# Altium project DB10011_DieBieMPPT.PrjPCB
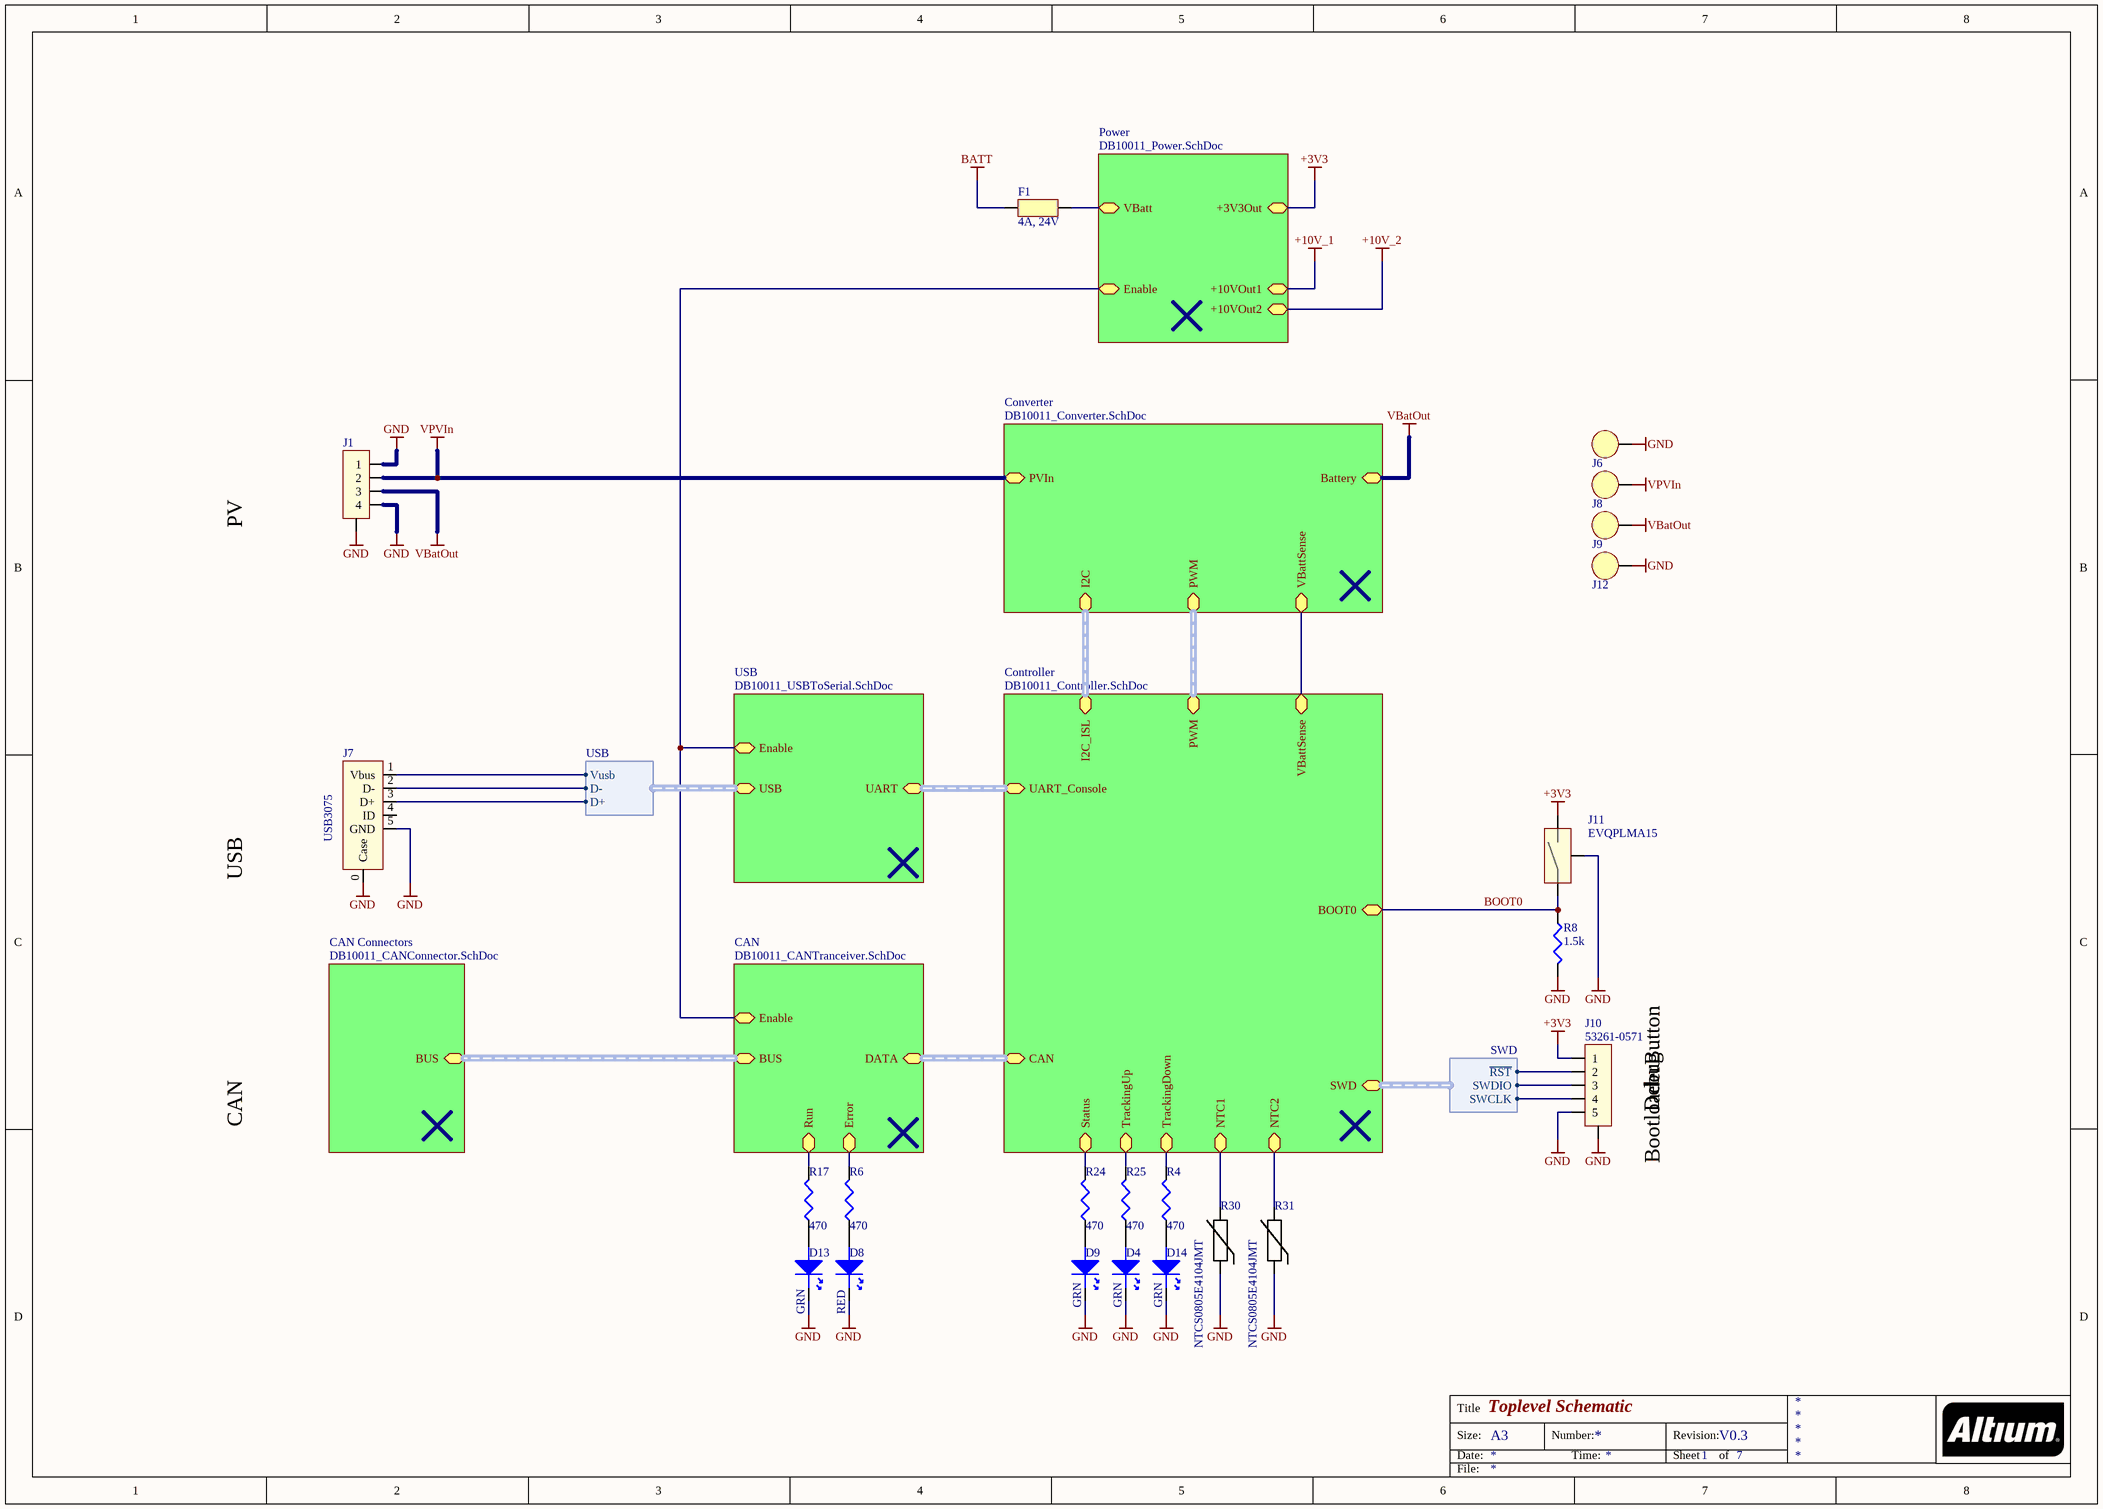
[diagram p0: DB10011_Toplevel.SchDoc]
7 sheets, 203 parts. Net scope: hierarchical (ports join the sheet entries above them; power ports are global).
Board file: DB10011_DieBieMPPT.PcbDoc
Sheets:
  DB10011_Toplevel.SchDoc
    Power = DB10011_Power.SchDoc
    Converter = DB10011_Converter.SchDoc
    Controller = DB10011_Controller.SchDoc
    CAN = DB10011_CANTranceiver.SchDoc
    USB = DB10011_USBToSerial.SchDoc
    CAN Connectors = DB10011_CANConnector.SchDoc

## Sheet DB10011_Toplevel.SchDoc: Toplevel Schematic
size A3; Engineer: Danny Bokma; Revision: V0.3; SheetNumber: 1; SheetTotal: 7

### Parts
D4  GRN  [WL-SMRW_1206 cylindrical_Reverse use]
D8  RED  [WL-SMRW_1206 cylindrical_Reverse use]
D9  GRN  [WL-SMRW_1206 cylindrical_Reverse use]
D13  GRN  [WL-SMRW_1206 cylindrical_Reverse use]
D14  GRN  [WL-SMRW_1206 cylindrical_Reverse use]
F1  4A, 24V  [F1206]
J1  Header 1x4  [PC 4/ 4-G-7,62]  (value not drawn)
J6  M3 5mm SMD spacer  [M3_5MM_Spacer]  (value not drawn)
J7  USB3075  [USB3075 - NOSLOT]
J8  M3 5mm SMD spacer  [M3_5MM_Spacer]  (value not drawn)
J9  M3 5mm SMD spacer  [M3_5MM_Spacer]  (value not drawn)
J10  53261-0571  [53261-0571]
J11  EVQPLMA15  [EVQPLM]
J12  M3 5mm SMD spacer  [M3_5MM_Spacer]  (value not drawn)
R4  470  [0402]
R6  470  [0402]
R8  1.5k  [0402]
R17  470  [0402]
R24  470  [0402]
R25  470  [0402]
R30  NTCS0805E4104JMT  [0805]
R31  NTCS0805E4104JMT  [0805]

### Sub-sheets
CAN = DB10011_CANTranceiver.SchDoc: Enable, BUS (harness CAN), Error, Run, DATA (harness CAN_DATA)
CAN Connectors = DB10011_CANConnector.SchDoc: BUS (harness CAN)
Controller = DB10011_Controller.SchDoc: I2C_ISL (harness I2C), VBattSense, PWM (harness PWM), CAN (harness CAN_DATA), UART_Console (harness SERIAL), TrackingUp, TrackingDown, Status, BOOT0, SWD (harness SWD), NTC1, NTC2
Converter = DB10011_Converter.SchDoc: PVIn, Battery, VBattSense, I2C (harness I2C), PWM (harness PWM)
Power = DB10011_Power.SchDoc: VBatt, +3V3Out, Enable, +10VOut1, +10VOut2
USB = DB10011_USBToSerial.SchDoc: UART (harness SERIAL), Enable, USB (harness USB)

### Harnesses
SWD: SWCLK, SWDIO, ~{RST}
USB: Vusb, D+, D-

### Nets
+3V3: J10.1 J11.2 ; sheet Power/+3V3Out
BATT: F1.2
GND: D4.1(K) D8.1(K) D9.1(K) D13.1(K) D14.1(K) J1.0 J1.1 J1.4 J6.0 J7.0(Case) J7.5(GND) J10.0(SHLD) J10.5 J11.0(GND) J12.0 R8.1 R30.1 R31.1
VBatOut: J1.3 J9.0 ; sheet Converter/Battery
VPVIn: J1.2 J8.0 ; sheet Converter/PVIn
BOOT0: J11.1 R8.2 ; sheet Controller/BOOT0
LED_CAN_ERROR: R17.2 ; sheet CAN/Run
LED_CAN_RUN: R6.2 ; sheet CAN/Error
LED_STATUS: R24.2 ; sheet Controller/Status
~{RST}: J10.2 ; sheet Controller/SWD.~{RST}
NetC3_2: sheet Converter/VBattSense, sheet Controller/VBattSense
NetC18_2: J7.1(Vbus) ; sheet USB/USB.Vusb
NetC74_1: R30.2 ; sheet Controller/NTC1
NetC75_1: R31.2 ; sheet Controller/NTC2
NetD4_2: D4.2(A) R25.1
NetD6_4: sheet Power/Enable, sheet CAN/Enable, sheet USB/Enable
NetD8_2: D8.2(A) R6.1
NetD9_2: D9.2(A) R24.1
NetD10_K1: J7.2(D-) ; sheet USB/USB.D-
NetD10_K2: J7.3(D+) ; sheet USB/USB.D+
NetD13_2: D13.2(A) R17.1
NetD14_2: D14.2(A) R4.1
NetF1_1: F1.1 ; sheet Power/VBatt
NetIC_14: R4.2 ; sheet Controller/TrackingDown
NetIC_15: R25.2 ; sheet Controller/TrackingUp
NetIC_23: J10.3 ; sheet Controller/SWD.SWDIO
NetIC_24: J10.4 ; sheet Controller/SWD.SWCLK

Not connected (* = marked no-connect by the designer): J7 4(ID)

### Buses and harness runs
harness sheet CAN Connectors/BUS = sheet CAN/BUS
harness sheet CAN/DATA = sheet Controller/CAN
harness sheet Controller/I2C_ISL = sheet Converter/I2C
harness sheet Controller/PWM = sheet Converter/PWM
harness sheet Controller/UART_Console = sheet USB/UART

### Notes on the sheet
- PV
- USB
- BootloaderButton
- CAN
- (near J10) Debug
- Title
- Size:
- Date:
- A3
- Number:
- Time:
- Revision:
- Sheet
- of
- File:

### Library data of the parts
D4 D9 D13 D14 = 156120GS75300: LED, Reverse Mount, Cylindrical, Green; Brand: Wurth; Brand Number: 156120GS75300; Order Code Supplier: 2322091; Price: 0,519; Supplier: Farnell
D8 = 156120RS75300: LED, Reverse Mount, Cylindrical, Red; Brand: Wurth; Brand Number: 156120RS75300; Order Code Supplier: 2322094; Price: 0,519; Supplier: Farnell
F1 = MC12CT 004: Fuse, Slow Blow, 4A, 24V, T:-55°C +125°C; Prijs: 0,161; Brand: MULTICOMP; Order Code Supplier: 1841066; Brand Number: MC12CT 004; Supplier: Farnell
J1 = PC 4/4-G-7,62_1: Header, Close Horizontal, 1x4, Male, 7.62mm, TH; Brand: PHOENIX CONTACT; Brand Number: PC 4/4-G-7,62; Case Style: *; Order Code Supplier: 1792930; Pitch: 7.62mm; Price: 2,92; Supplier: Farnell
J6 J8 J9 J12 = 9774050360RWPad: M3 5MM Spacer; Brand: WURTH ELEKTRONIK; Brand Number: 9774050360R; Price: 1.91; Order Code Supplier: 2438004; Supplier: WURTH ELEKTRONIK
J7 = USB3075: USB 2.0 MICRO B, RCPT, 5POS, SMT; Brand: Global Connector Technology; Brand Number: USB3075-30-A; Case Style: Micro B SMT; Pitch: 0.8mm; Order Code Supplier: 2443116; Price: 0,313; Supplier: Farnell
J10 = 53261-0571: PicoBlade 53261 Series, 5Pin, Right Angle; Brand: MOLEX; Pitch: 1.25mm; Brand Number: 53261-0571; Case Style: 53261-0571; Order Code Supplier: 1125360; Price: 1,20; Supplier: Farnell
J11 = EVQPLMA15: SWITCH, TACT, 4.9MM, SMD, 2.6N; Brand: PANASONIC ELECTRONIC COMPONENTS; Brand Number: EVQPLMA15; Price: 0,169; Order Code Supplier: 2079484; Supplier: Farnell
R4 R6 R17 R24 R25 = 470/0402/0063W/50V: Resistor, 470, 1%, 0.0625W, 50V, 100PPM, 0402; Brand: VISHAY DRALORIC; Brand Number: CRG0402F470R; Power Rating: 0.063W; Case Style: 0402; Order Code Supplier: 2331533; Price: 0,0099; Resistance: 470; Supplier: Farnell; Temperature Coefficient: ± 100PPM; Temperature Range: -55°C to +125°C; Voltage Rating: 50V
R8 = 1.5k/0402/0063W/50V: Resistor, 1.5k, 0.1%, 0.0625W, 50V, 100PPM, 0402; Brand: VISHAY DRALORIC; Brand Number: CRCW04021K50FKED; Power Rating: 0.063W; Case Style: 0402; Order Code Supplier: 2121624; Price: 0,0054; Resistance: 1.5k; Supplier: Farnell; Temperature Coefficient: ± 100PPM; Temperature Range: -55°C to +125°C; Voltage Rating: 50V
R30 R31 = NTCS0805E4104JMT: THERMISTOR, NTC, 100K, 5%; Brand: VISHAY; Supplier: Farnell; Case Style: 0805; Price: 0,65; Order Code Supplier: 1187095; Brand Number: NTCS0805E4104JMT

## Sheet DB10011_Power.SchDoc: Power supplies
size A3; Engineer: Danny Bokma; Revision: V0.3; SheetNumber: 4; SheetTotal: 7
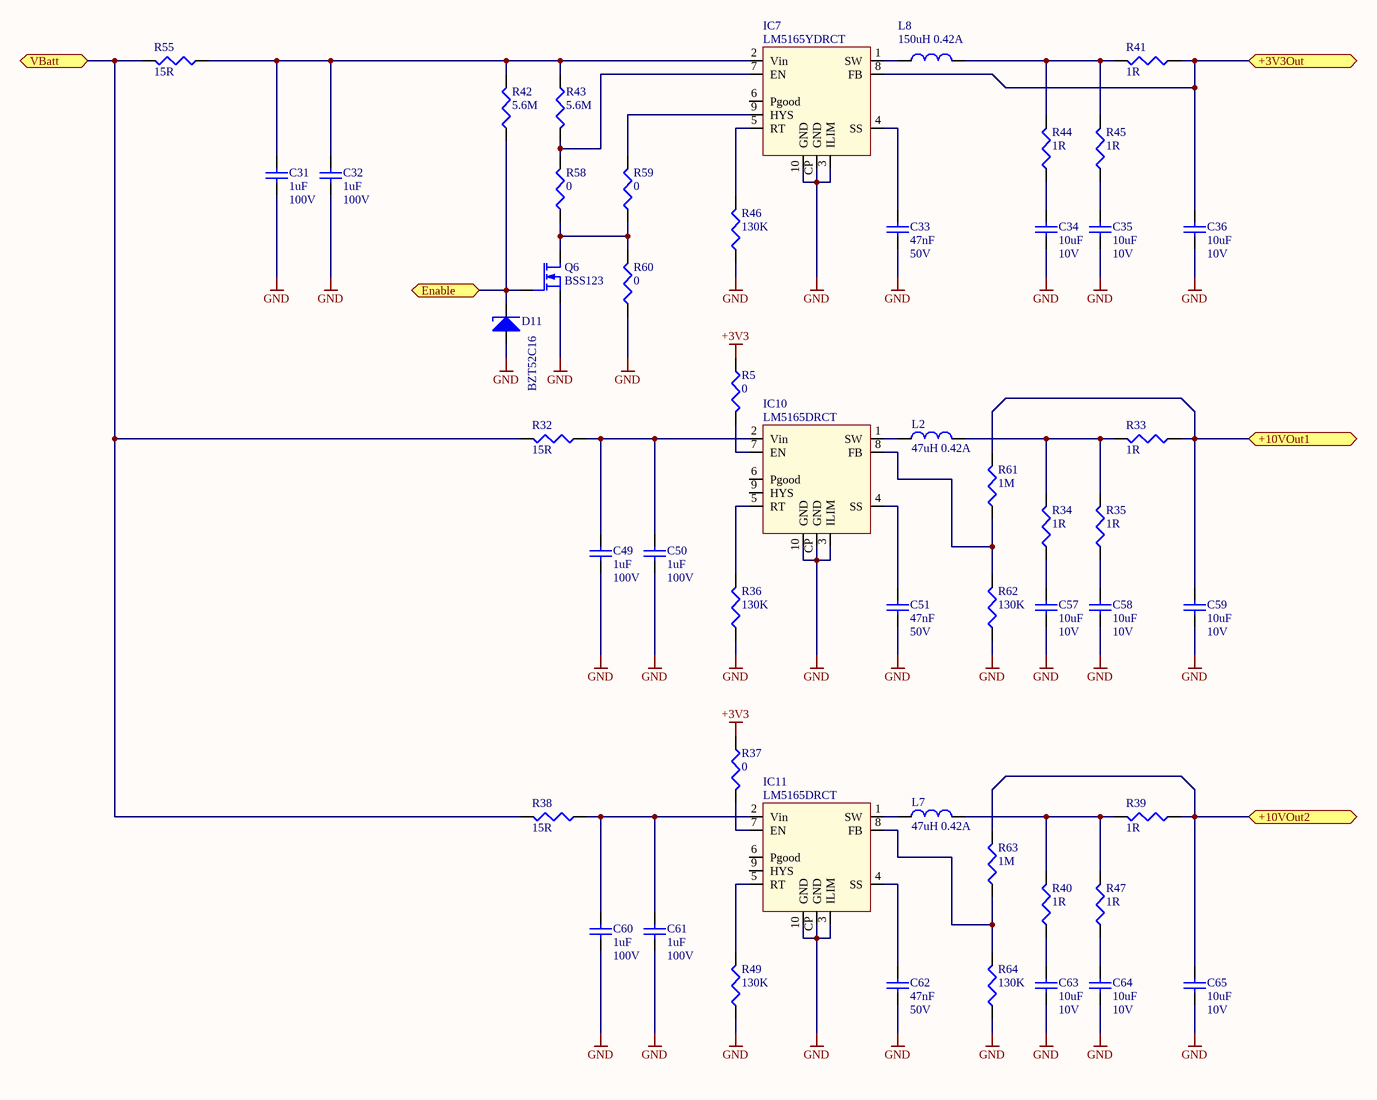
[diagram p1: DB10011_Power.SchDoc]

### Parts
C31  1uF  Voltage Rating: 100V  [C-1206]
C32  1uF  Voltage Rating: 100V  [C-1206]
C33  47nF  Voltage Rating: 50V  [C0603]
C34  10uF  Voltage Rating: 10V  [C-0805]
C35  10uF  Voltage Rating: 10V  [C-0805]
C36  10uF  Voltage Rating: 10V  [C-0805]
C49  1uF  Voltage Rating: 100V  [C-1206]
C50  1uF  Voltage Rating: 100V  [C-1206]
C51  47nF  Voltage Rating: 50V  [C0603]
C57  10uF  Voltage Rating: 10V  [C-0805]
C58  10uF  Voltage Rating: 10V  [C-0805]
C59  10uF  Voltage Rating: 10V  [C-0805]
C60  1uF  Voltage Rating: 100V  [C-1206]
C61  1uF  Voltage Rating: 100V  [C-1206]
C62  47nF  Voltage Rating: 50V  [C0603]
C63  10uF  Voltage Rating: 10V  [C-0805]
C64  10uF  Voltage Rating: 10V  [C-0805]
C65  10uF  Voltage Rating: 10V  [C-0805]
D11  BZT52C16  [SOD123]
IC7  LM5165YDRCT  [PWSON10]
IC10  LM5165DRCT  [PWSON10]
IC11  LM5165DRCT  [PWSON10]
L2  47uH 0.42A  [WE-TPC 4828, MH]
L7  47uH 0.42A  [WE-TPC 4828, MH]
L8  150uH 0.42A  [WE-TPC 4828, MH]
Q6  BSS123  [SOT-23]
R5  0  [0402]
R32  15R  [0805]
R33  1R  [0805]
R34  1R  [0805]
R35  1R  [0805]
R36  130K  [0603]
R37  0  [0402]
R38  15R  [0805]
R39  1R  [0805]
R40  1R  [0805]
R41  1R  [0805]
R42  5.6M  [0805]
R43  5.6M  [0805]
R44  1R  [0805]
R45  1R  [0805]
R46  130K  [0603]
R47  1R  [0805]
R49  130K  [0603]
R55  15R  [0805]
R58  0  [0402]
R59  0  [0402]
R60  0  [0402]
R61  1M  [0402]
R62  130K  [0603]
R63  1M  [0402]
R64  130K  [0603]

### Ports
+3V3Out, +10VOut1, +10VOut2, Enable, VBatt

### Nets
+3V3: C36.2 IC7.8(FB) R5.1 R37.1 R41.1 ; port +3V3Out
+10V_1: C59.2 R33.1 R61.2 ; port +10VOut1
+10V_2: C65.2 R39.1 R63.2 ; port +10VOut2
GND: C31.1 C32.1 C33.1 C34.1 C35.1 C36.1 C49.1 C50.1 C51.1 C57.1 C58.1 C59.1 C60.1 C61.1 C62.1 C63.1 C64.1 C65.1 D11.1(A) IC7.3(ILIM) IC7.10(GND) IC7.CP(GND) IC10.3(ILIM) IC10.10(GND) IC10.CP(GND) IC11.3(ILIM) IC11.10(GND) IC11.CP(GND) Q6.S R36.1 R46.1 R49.1 R60.1 R62.1 R64.1
NetC31_2: C31.2 C32.2 IC7.2(Vin) R42.2 R43.1 R55.1
NetC33_2: C33.2 IC7.4(SS)
NetC34_2: C34.2 R44.1
NetC35_2: C35.2 R45.1
NetC49_2: C49.2 C50.2 IC10.2(Vin) R32.1
NetC51_2: C51.2 IC10.4(SS)
NetC57_2: C57.2 R34.1
NetC58_2: C58.2 R35.1
NetC60_2: C60.2 C61.2 IC11.2(Vin) R38.1
NetC62_2: C62.2 IC11.4(SS)
NetC63_2: C63.2 R40.1
NetC64_2: C64.2 R47.1
NetD6_4: D11.2(K) Q6.G R42.1 ; port Enable
NetF1_1: R32.2 R38.2 R55.2 ; port VBatt
NetIC7_1: IC7.1(SW) L8.1
NetIC7_5: IC7.5(RT) R46.2
NetIC7_7: IC7.7(EN) R43.2 R58.2
NetIC7_9: IC7.9(HYS) R59.2
NetIC10_1: IC10.1(SW) L2.1
NetIC10_5: IC10.5(RT) R36.2
NetIC10_7: IC10.7(EN) R5.2
NetIC10_8: IC10.8(FB) R61.1 R62.2
NetIC11_1: IC11.1(SW) L7.1
NetIC11_5: IC11.5(RT) R49.2
NetIC11_7: IC11.7(EN) R37.2
NetIC11_8: IC11.8(FB) R63.1 R64.2
NetL2_2: L2.2 R33.2 R34.2 R35.2
NetL7_2: L7.2 R39.2 R40.2 R47.2
NetL8_2: L8.2 R41.2 R44.2 R45.2
NetQ6_D: Q6.D R58.1 R59.1 R60.2

Not connected (* = marked no-connect by the designer): IC7 6(Pgood); IC10 6(Pgood) 9(HYS); IC11 6(Pgood) 9(HYS)

### Notes on the sheet
- Title
- Size:
- Date:
- A3
- Number:
- Time:
- Revision:
- Sheet
- of
- File:

### Library data of the parts
C31 C32 C49 C50 C60 C61 = 1uF/1206/CER/100V: Capacitor, 1uF, 100V, X7R; Capacitance Tolerance: ± 10%; Capacitor Case Style: 1206; Brand Number: 12061C105K4Z2A; Brand: AVX; Dielectric Characteristic: X7R; Capacitance: 1uF; Temperature Range: -55°C to +125°C; Price: 0,52; Order Code Supplier: 1833855; Supplier: Farnell
C33 C51 C62 = 47nF/0603/CER/50V: Capacitor, 47nF, 50V, X7R; Capacitance Tolerance: ± 10%; Capacitor Case Style: 0603; Brand Number: MCCA000249; Brand: MULTICOMP; Dielectric Characteristic: X7R; Capacitance: 47nF; Temperature Range: -55°C to +125°C; Price: 0,009; Order Code Supplier: 1759116; Supplier: Farnell
C34-C36 C57-C59 C63-C65 = 10uF/0805/CER/10V: Capacitor, 10uF, 10V, X7R; Capacitance Tolerance: ± 10%; Capacitor Case Style: 0805; Brand Number: GRM21BR71A106KE51L; Brand: MURATA; Dielectric Characteristic: X7R; Capacitance: 10uF; Temperature Range: -55°C to +125°C; Price: 0,36; Order Code Supplier: 1828828; Supplier: Farnell
D11 = BZT52C16: Diode Zener, Vz: 16V, If: 0.1A, Vf: 0.9V; Brand: Diodes; Case Style: SOD-123; Brand Number: BZT52C16; Forward Current: 0.1A; Forward Voltage: 0.9V; Order Code Supplier: 1902431; Price: 0,087; Supplier: Farnell; Temperature Range: -65°C to +150°C; Zener Voltage: 16V
IC7 = LM5165Y: Buck Vreg 150mA 3V3 out 5-65Vin; Brand: Texas Instruments; Case Style: MSOP-8; Price: 3,70; Order Code Supplier: 595-LM5165YDRCT; Brand Number: LM5165YDRCT; Temperature Range: -40°C to +85°C; Supplier: Mouser
IC10 IC11 = LM5165D: Buck Vreg 150mA Adj Vout 5-65Vin; Brand: Texas Instruments; Case Style: MSOP-8; Price: 3,70; Order Code Supplier: 595-LM5165DRCT; Brand Number: LM5165DRCT; Temperature Range: -40°C to +85°C; Supplier: Mouser
L2 L7 = 744043470: 47UH, 30%, 0.75A; Brand: Wurth; Case Style: WE-TPC 4828; Inductance: 150uH; DC Resistance: 0.280ohm; Brand Number: 744043470; DC Current: 0.75A; Order Code Supplier: 1890607; Price: 1,36; Q Factor: *; Supplier: Farnell; Temperature Range: -40°C to +125°C
L8 = 744043151: 150UH, 30%, 0.42A; Brand: Wurth; Case Style: WE-TPC 4828; DC Resistance: 0.770ohm; Brand Number: 744043151; DC Current: 0.42A; Inductance: 150uH; Order Code Supplier: 2082517; Price: 1,36; Q Factor: *; Supplier: Farnell; Temperature Range: -40°C to +125°C
Q6 = BSS123: Mosfet, N-channel, Vds:100V, Id:0.15A, Vgs-th:2.8V, Rds-on:3.5ohm; Brand: NXP; Drain Current: 0.15A; Drain Source Voltage: 100V; Gate Source Voltage: 20V; On Resistance: 3.5ohm; Threshold Voltage: 2.8V; Brand Number: BSS123; Case Style: SOT-23; Order Code Supplier: 1510764; Price: 0,082; Supplier: Farnell; Temperature Range: -55°C to +150°C; Transistor Polarity: N-channel
R5 R37 R58-R60 = 0/0402/0063W/50V: Resistor, 0, 0.1%, 0.0625W, 50V, 100PPM, 0402; Brand: VISHAY DRALORIC; Brand Number: CRCW04020000Z0ED; Power Rating: 0.063W; Case Style: 0402; Order Code Supplier: 2121349; Price: 0,0021; Resistance: 0; Supplier: Farnell; Temperature Coefficient: ± 100PPM; Temperature Range: -55°C to +125°C; Voltage Rating: 50V
R32 R38 R55 = 15/0805/0125W/150V: Resistor, 15R, 0.1%, 0.125W, 150V, 15PPM, 0805; Brand: YAGEO; Brand Number: RC0805JR-0715RL; Case Style: 0805; Order Code Supplier: 9233784; Power Rating: 0.125W; Price: 0,0161; Resistance: 15R; Supplier: Farnell; Temperature Coefficient: ± 15PPM; Temperature Range: -55°C to +155°C; Voltage Rating: 150V
R33-R35 R39-R41 R44 R45 R47 = 1/0805/0250W/150V: Resistor, 1R, 1%, 0.25W, 150V, 200PPM, 0805; Brand: PANASONIC; Brand Number: ERJ6BQF1R0V; Case Style: 0805; Order Code Supplier: 1717826; Power Rating: 0.25W; Price: 0,28; Resistance: 1R; Supplier: Farnell; Temperature Coefficient: ± 200PPM; Temperature Range: -55°C to +125°C; Voltage Rating: 150V
R36 R46 R49 R62 R64 = 130K/0603/0063W/50V: Resistor, 130K, 1%, 0.063W, 50V, 100PPM, 0603; Brand: VISHAY DRALORIC; Brand Number: CRCW0603130KFKEA; Case Style: 0603; Order Code Supplier: 2122632; Power Rating: 0.063W; Price: 0,017; Resistance: 130K; Supplier: Farnell; Temperature Coefficient: ± 100PPM; Temperature Range: -55°C to +125°C; Voltage Rating: 50V
R42 R43 = 5.6M/0805/0250W/150V: Resistor, 5.6M, 1%, 0.25W, 150V, 100PPM, 0805; Brand: MULTICOMP; Brand Number: MCHP05W4F5604T5E; Case Style: 0805; Order Code Supplier: 1576517; Power Rating: 0.25W; Price: 0,089; Resistance: 5.6M; Supplier: Farnell; Temperature Coefficient: ± 100PPM; Temperature Range: -55°C to +155°C; Voltage Rating: 150V
R61 R63 = 1M/0402/0063W/50V: Resistor, 1M, 0.1%, 0.0625W, 50V, 100PPM, 0402; Brand: VISHAY DRALORIC; Brand Number: CRCW04021M00FKED; Power Rating: 0.063W; Case Style: 0402; Order Code Supplier: 2121984; Price: 0,0006; Resistance: 1M; Supplier: Farnell; Temperature Coefficient: ± 100PPM; Temperature Range: -55°C to +125°C; Voltage Rating: 50V

## Sheet DB10011_Converter.SchDoc: Power converters
size A3; Engineer: Danny Bokma; Revision: V0.3; SheetNumber: 3; SheetTotal: 7
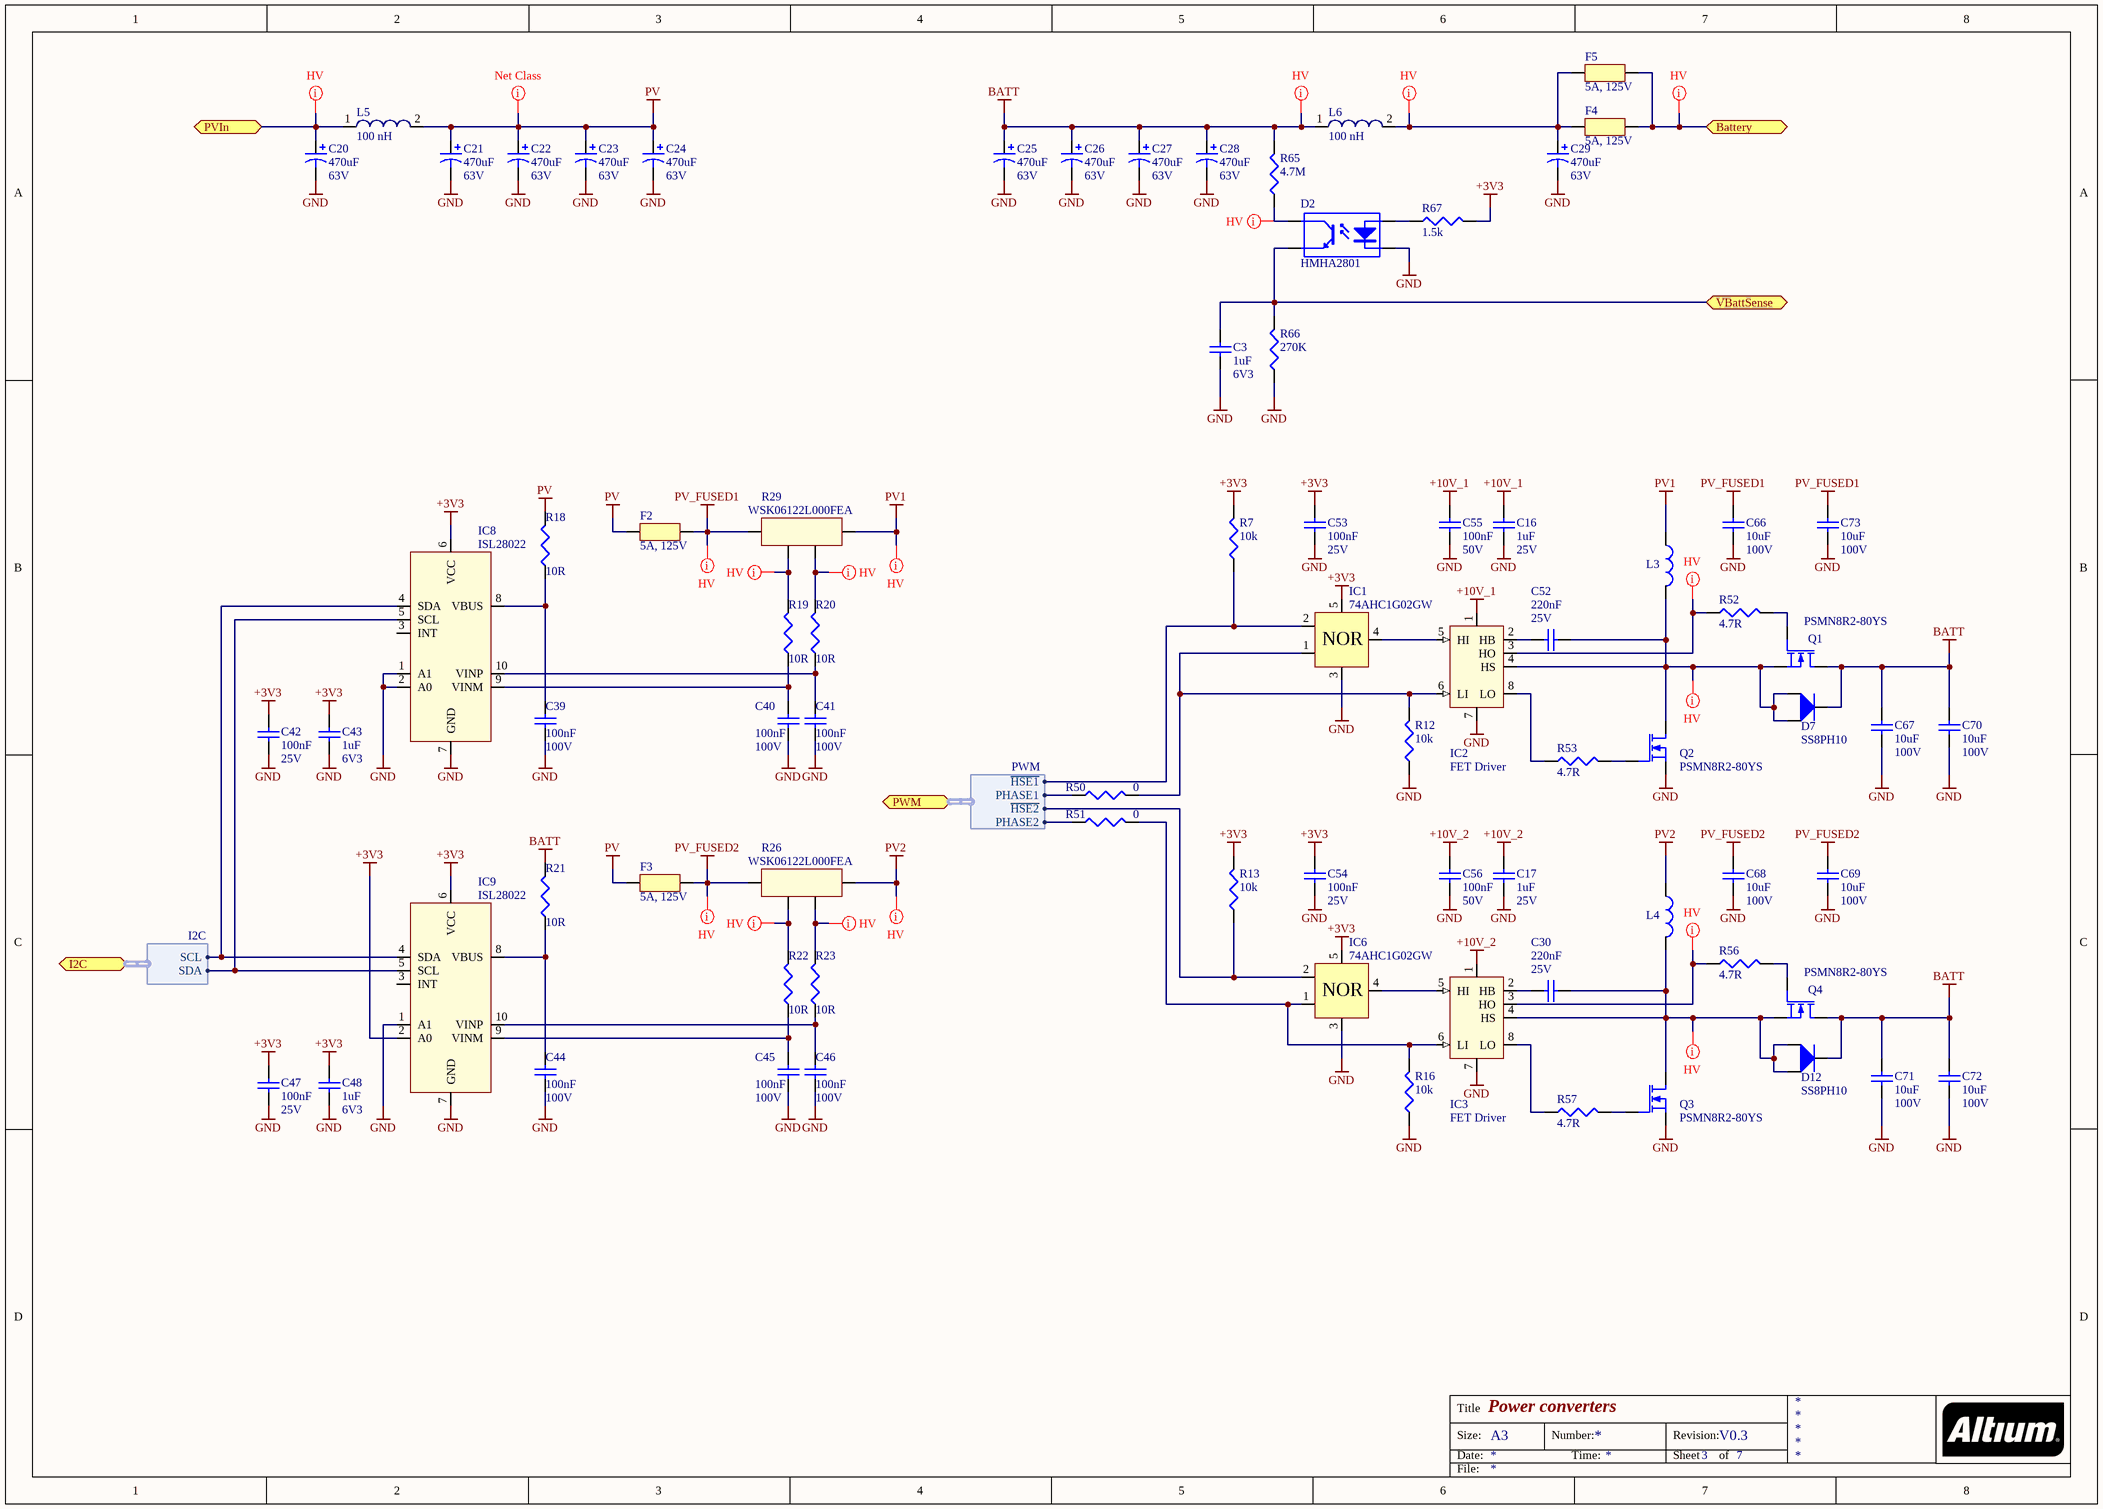
[diagram p2: DB10011_Converter.SchDoc]

### Parts
C3  1uF  Voltage Rating: 6V3  [C0402]
C16  1uF  Voltage Rating: 25V  [C0603]
C17  1uF  Voltage Rating: 25V  [C0603]
C20  470uF  Voltage Rating: 63V  [Radial-16]
C21  470uF  Voltage Rating: 63V  [Radial-16]
C22  470uF  Voltage Rating: 63V  [Radial-16]
C23  470uF  Voltage Rating: 63V  [Radial-16]
C24  470uF  Voltage Rating: 63V  [Radial-16]
C25  470uF  Voltage Rating: 63V  [Radial-16]
C26  470uF  Voltage Rating: 63V  [Radial-16]
C27  470uF  Voltage Rating: 63V  [Radial-16]
C28  470uF  Voltage Rating: 63V  [Radial-16]
C29  470uF  Voltage Rating: 63V  [Radial-16]
C30  220nF  Voltage Rating: 25V  [C0603]
C39  100nF  Voltage Rating: 100V  [C-0805]
C40  100nF  Voltage Rating: 100V  [C-0805]
C41  100nF  Voltage Rating: 100V  [C-0805]
C42  100nF  Voltage Rating: 25V  [C0402]
C43  1uF  Voltage Rating: 6V3  [C0402]
C44  100nF  Voltage Rating: 100V  [C-0805]
C45  100nF  Voltage Rating: 100V  [C-0805]
C46  100nF  Voltage Rating: 100V  [C-0805]
C47  100nF  Voltage Rating: 25V  [C0402]
C48  1uF  Voltage Rating: 6V3  [C0402]
C52  220nF  Voltage Rating: 25V  [C0603]
C53  100nF  Voltage Rating: 25V  [C0402]
C54  100nF  Voltage Rating: 25V  [C0402]
C55  100nF  Voltage Rating: 50V  [C0603]
C56  100nF  Voltage Rating: 50V  [C0603]
C66  10uF  Voltage Rating: 100V  [C2220]
C67  10uF  Voltage Rating: 100V  [C2220]
C68  10uF  Voltage Rating: 100V  [C2220]
C69  10uF  Voltage Rating: 100V  [C2220]
C70  10uF  Voltage Rating: 100V  [C2220]
C71  10uF  Voltage Rating: 100V  [C2220]
C72  10uF  Voltage Rating: 100V  [C2220]
C73  10uF  Voltage Rating: 100V  [C2220]
D2  HMHA2801  [FSOP4]
D7  SS8PH10  [TO277A]
D12  SS8PH10  [TO277A]
F2  5A, 125V  [SMF]
F3  5A, 125V  [SMF]
F4  5A, 125V  [SMF]
F5  5A, 125V  [SMF]
IC1  74AHC1G02GW  [SOT-23-5]
IC2  FET Driver  [SO-8]
IC3  FET Driver  [SO-8]
IC6  74AHC1G02GW  [SOT-23-5]
IC8  ISL28022  [MSOP10]
IC9  ISL28022  [MSOP10]
L3  ETD39Custom  [ETD39]  (value not drawn)
L4  ETD39Custom  [ETD39]  (value not drawn)
L5  100 nH  [WE-HCM 1240]
L6  100 nH  [WE-HCM 1240]
Q1  PSMN8R2-80YS  [SOT-669]
Q2  PSMN8R2-80YS  [SOT-669]
Q3  PSMN8R2-80YS  [SOT-669]
Q4  PSMN8R2-80YS  [SOT-669]
R7  10k  [0402]
R12  10k  [0402]
R13  10k  [0402]
R16  10k  [0402]
R18  10R  [0603]
R19  10R  [0603]
R20  10R  [0603]
R21  10R  [0603]
R22  10R  [0603]
R23  10R  [0603]
R26  WSK06122L000FEA  [WSK0612]
R29  WSK06122L000FEA  [WSK0612]
R50  0  [0402]
R51  0  [0402]
R52  4.7R  [0603]
R53  4.7R  [0603]
R56  4.7R  [0603]
R57  4.7R  [0603]
R65  4.7M  [0805]
R66  270K  [0402]
R67  1.5k  [0402]

### Ports
Battery, I2C (harness I2C), PVIn, PWM (harness PWM), VBattSense

### Harnesses
PWM: PHASE2, PHASE1, ~{HSE1}, ~{HSE2}
I2C: SDA, SCL

### Nets
+3V3: C42.2 C43.2 C47.2 C48.2 C53.1 C54.1 IC1.5(VCC) IC6.5(VCC) IC8.6(VCC) IC9.2(A0) IC9.6(VCC) R7.2 R13.2 R67.2
+10V_1: C16.2 C55.1 IC2.1(VDD)
+10V_2: C17.2 C56.1 IC3.1(VDD)
BATT: C25.1 C26.1 C27.1 C28.1 C67.2 C70.2 C71.2 C72.2 D7.K D12.K L6.1 Q1.D Q4.D R21.2 R65.2
GND: C3.1 C16.1 C17.1 C20.2 C21.2 C22.2 C23.2 C24.2 C25.2 C26.2 C27.2 C28.2 C29.2 C39.1 C40.1 C41.1 C42.1 C43.1 C44.1 C45.1 C46.1 C47.1 C48.1 C53.2 C54.2 C55.2 C56.2 C66.1 C67.1 C68.1 C69.1 C70.1 C71.1 C72.1 C73.1 D2.2(K1) IC1.3(GND) IC2.7(VSS) IC3.7(VSS) IC6.3(GND) IC8.1(A1) IC8.2(A0) IC8.7(GND) IC9.1(A1) IC9.7(GND) Q2.S Q3.S R12.1 R16.1 R66.1
PV: C21.1 C22.1 C23.1 C24.1 F2.1 F3.1 L5.2 R18.2
PV1: L3.1 R29.a
PV2: L4.1 R26.a
PV_FUSED1: C66.2 C73.2 F2.2 R29.b
PV_FUSED2: C68.2 C69.2 F3.2 R26.b
VBatOut: F4.2 F5.2 ; port Battery
VPVIn: C20.1 L5.1 ; port PVIn
NetC3_2: C3.2 D2.3(E1) R66.2 ; port VBattSense
NetC29_1: C29.1 F4.1 F5.1 L6.2
NetC30_1: C30.1 D12.1(A) D12.2(A) IC3.4(HS) L4.2 Q3.D Q4.S
NetC30_2: C30.2 IC3.2(HB)
NetC39_2: C39.2 IC8.8(VBUS) R18.1
NetC40_2: C40.2 IC8.9(VINM) R19.1
NetC41_2: C41.2 IC8.10(VINP) R20.1
NetC44_2: C44.2 IC9.8(VBUS) R21.1
NetC45_2: C45.2 IC9.9(VINM) R22.1
NetC46_2: C46.2 IC9.10(VINP) R23.1
NetC52_1: C52.1 D7.1(A) D7.2(A) IC2.4(HS) L3.2 Q1.S Q2.D
NetC52_2: C52.2 IC2.2(HB)
NetD2_1: D2.1(A1) R67.1
NetD2_4: D2.4(C1) R65.1
NetIC1_1: IC1.1(B) IC2.6(LI) R12.2 R50.2
NetIC1_4: IC1.4(Y) IC2.5(HI)
NetIC2_3: IC2.3(HO) R52.1
NetIC2_8: IC2.8(LO) R53.1
NetIC3_3: IC3.3(HO) R56.1
NetIC3_5: IC3.5(HI) IC6.4(Y)
NetIC3_6: IC3.6(LI) IC6.1(B) R16.2 R51.2
NetIC3_8: IC3.8(LO) R57.1
NetIC_18: R50.1 ; port PWM.PHASE1
NetIC_19: R51.1 ; port PWM.PHASE2
NetIC_20: IC1.2(A) R7.1 ; port PWM.~{HSE1}
NetIC_25: IC6.2(A) R13.1 ; port PWM.~{HSE2}
NetIC_29: IC8.4(SDA) IC9.4(SDA) ; port I2C.SCL
NetIC_30: IC8.5(SCL) IC9.5(SCL) ; port I2C.SDA
NetQ1_G: Q1.G R52.2
NetQ2_G: Q2.G R53.2
NetQ3_G: Q3.G R57.2
NetQ4_G: Q4.G R56.2
NetR19_2: R19.2 R29.bs
NetR20_2: R20.2 R29.as
NetR22_2: R22.2 R26.bs
NetR23_2: R23.2 R26.as

Not connected (* = marked no-connect by the designer): IC8 3(INT); IC9 3(INT)

### Layout directives
net class 0.5mm: BATT, NetC29_1, NetC30_1, NetC52_1, NetD2_4, NetIC2_3, NetIC3_3, NetR19_2, NetR20_2, NetR22_2, NetR23_2, PV, PV1, PV2, PV_FUSED1, PV_FUSED2, VBatOut, VPVIn

### Notes on the sheet
- Title
- Size:
- Date:
- A3
- Number:
- Time:
- Revision:
- Sheet
- of
- File:
- (in symbol 74AHC1G02GW) NOR

### Library data of the parts
C3 C43 C48 = 1uF/0402/CER/6.3V: Capacitor, 1uF, 6.3V, X5R; Capacitance Tolerance: ± 10%; Capacitor Case Style: 0402; Brand Number: 04026D105KAT2A; Brand: AVX; Dielectric Characteristic: X5R; Capacitance: 1uF; Temperature Range: -55°C to +85°C; Price: 0,0874; Order Code Supplier: 1327658; Supplier: Farnell
C16 C17 = 1uF/0603/CER/25V: Capacitor, 1uF, 25V, X7R; Capacitance Tolerance: ± 10%; Capacitor Case Style: 0603; Brand Number: GRM188R71E105KA12D; Brand: MURATA; Dielectric Characteristic: X7R; Capacitance: 1uF; Temperature Range: -55°C to +125°C; Price: 0,186; Order Code Supplier: 1735540; Supplier: Farnell
C20-C29 = 470uF/ALU/63V: Aluminum Electrolytic Capacitor, 470uF, 63V; Capacitance Tolerance: ± 20%; Capacitor Case Style: Radial Leaded 16; Brand Number: 63ZL470MEFC16X20; Brand: RUBYCON; Dielectric Characteristic: *; Capacitance: 470uF; Temperature Range: -40°C to +105°C; Price: 1,23; Order Code Supplier: 1281841; Supplier: Farnell
C30 C52 = 220nF/0603/CER/25V: Capacitor, 220nF, 25V, X7R; Capacitance Tolerance: ± 10%; Capacitor Case Style: 0603; Brand Number: 06033C224KAT2A; Brand: AVX; Dielectric Characteristic: X7R; Capacitance: 220nF; Temperature Range: -55°C to +125°C; Price: 0,111; Order Code Supplier: 1833865; Supplier: Farnell
C39-C41 C44-C46 = 100nF/0805/CER/100V: Capacitor, 100nF, 100V, X7R; Capacitance Tolerance: ± 10%; Capacitor Case Style: 0805; Brand Number: C0805C104K1RACTU; Brand: KEMET; Dielectric Characteristic: X7R; Capacitance: 100nF; Temperature Range: -55°C to +125°C; Price: 0,096; Order Code Supplier: 1650862; Supplier: Farnell
C42 C47 C53 C54 = 100nF/0402/CER/25V: Capacitor, 100nF, 25V, X7R; Capacitance Tolerance: 10nF; Capacitor Case Style: 0402; Brand Number: GRM155R71E104KE14D; Brand: MULTICOMP; Dielectric Characteristic: X7R; Capacitance: 100nF; Temperature Range: -55 to +125 C; Price: 0,0225; Order Code Supplier: 2456106; Supplier: Farnell
C55 C56 = 100nF/0603/CER/50V: Capacitor, 100nF, 50V, X7R; Capacitance Tolerance: ± 10%; Capacitor Case Style: 0603; Brand Number: MCCA000255; Brand: MULTICOMP; Dielectric Characteristic: X7R; Capacitance: 100nF; Temperature Range: -55°C to +125°C; Price: 0,008; Order Code Supplier: 1759122RL; Supplier: Farnell
C66-C73 = 10uF/2220/CER/100V: Capacitor, 10uF, 100V, X7S; Capacitance Tolerance: 20%; Capacitor Case Style: 2220; Brand Number: C5750X7S2A106M230KB; Brand: TDK; Dielectric Characteristic: X7S; Capacitance: 10uF; Temperature Range: *; Price: 1,77; Order Code Supplier: 2112740; Supplier: Farnell
D2 = HMHA2801: Optocoupler, Vout:80V, Iin:0.01A; Brand: FAIRCHILD SEMICONDUCTOR; Isolation Voltage: 2500V; Input Current: 0.01A; Output Voltage: 80V; Brand Number: HMHA2801; Case Style: *; Price: 0,28; Order Code Supplier: 1652504; Supplier: Farnell; Temperature Range: -55°C to +100°C
D7 D12 = SS8PH10: Diode 8A 100V; Brand Number: SS8PH10-M3/86A; Brand: VISHAY GENERAL; Supplier: Farnell; Case Style: TO277A; Price: 1,12; Order Code Supplier: 2335175
F2-F5 = 0452005.MRL: Fuse, Slow Blow, 5A, 125V, T:-55°C +125°C; Brand: LITTELFUSE; Case Style: SMD; Brand Number: 0452005.MRL; Price: 0,69; Order Code Supplier: 9922415; Supplier: Farnell
IC1 IC6 = 74AHC1G02GW: LOGIC, NOR Gate 2-Input; Case Style: SOT23-5; Brand Number: SN74AHC1G02DBVR; Brand: NXP; Supplier: Farnell; Price: 0,294; Order Code Supplier: 1287441
IC2 IC3 = UCC27211: Half bridge FET driver; Case Style: SOIC8; Brand Number: UCC27211DDA; Brand: TI; Supplier: Farnell; Price: 3,51; Order Code Supplier: 2099940
IC8 IC9 = ISL28022: Current and voltage ADC; Brand Number: ISL28022FUZ; Brand: Intersil; Supplier: Farnell; Case Style: MSOP10; Price: 3,44; Order Code Supplier: 2373594
L3 L4 = ETD39Custom: Custom inductor for MPPT; Manufacturer: FERROXCUBE; Order Code Manufacturer: CPH-ETD39-1S-16P-C; Supplier: Farnell; Order Code Supplier: 3056314; Price: 2,35
L5 L6 = WE-HCM 1240, 744304010: SMD Flat Wire Inductor WE-HCM Hight Current, L=100 nH; partNo: 744304010; Inductance: 100 nH; ComponentLink1Description: Manufacturer; ComponentLink1URL: http://www.we-online.de; Created by: Christin Zierenner; Created Date: August 2010; ComponentLink2URL: http://katalog.we-online.de/kataloge/eisos/media/pdf/744304010.pdf; ComponentLink2Description: Datasheet
Q1-Q4 = PSMN8R2-80YS: Mosfet, N-channel, Vds:80V, Id:82A, Vgs-th:4V, Rds-on:0.0058ohm; Brand: NXP; Drain Current: 82A; Drain Source Voltage: 80V; Gate Source Voltage: 20V; Threshold Voltage: 4V; Brand Number: PSMN8R2-80YS; Case Style: SOT-669; On Resistance: 0.0058ohm; Order Code Supplier: 1785646; Price: 1,39; Supplier: Farnell; Temperature Range: -55°C to +175°C; Transistor Polarity: N-channel
R7 R12 R13 R16 = 10k/0402/0063W/50V: Resistor, 10k, 0.1%, 0.0625W, 50V, 100PPM, 0402; Brand: VISHAY DRALORIC; Brand Number: CRCW040210K0FKED; Power Rating: 0.063W; Case Style: 0402; Order Code Supplier: 2121730; Price: 0,0005; Resistance: 10k; Supplier: Farnell; Temperature Coefficient: ± 100PPM; Temperature Range: -55°C to +125°C; Voltage Rating: 50V
R18-R23 = 10/0603/0063W/50V: Resistor, 10R, 1%, 0.063W, 50V, 200PPM, 0603; Brand: VISHAY DRALORIC; Brand Number: CRCW060310R0FKEA; Case Style: 0603; Order Code Supplier: 2122113; Power Rating: 0.063W; Price: 0,038; Resistance: 10R; Supplier: Farnell; Temperature Coefficient: ± 200PPM; Temperature Range: -55°C to +125°C; Voltage Rating: 50V
R26 R29 = WSK06122L000FEA: RES, METAL STRIP, 0.002OHM, 1%; Case Style: 0612; Brand: VISHAY; Supplier: Farnell; Price: 0,488; Order Code Supplier: 2420726; Brand Number: WSK06122L000FEA
R50 R51 = 0/0402/0063W/50V: as R5 on sheet DB10011_Power; Case Style: 0402; Order Code Supplier: 2121349; Price: 0,0021; Resistance: 0; Supplier: Farnell; Temperature Coefficient: ± 100PPM; Temperature Range: -55°C to +125°C; Voltage Rating: 50V
R52 R53 R56 R57 = 4.7/0603/0063W/50V: Resistor, 4.7R, 1%, 0.063W, 50V, 200PPM, 0603; Brand: VISHAY DALE; Brand Number: CRCW06034R70FKEA; Case Style: 0603; Order Code Supplier: 2371579; Power Rating: 0.063W; Price: 0,038; Resistance: 4.7R; Supplier: Farnell; Temperature Coefficient: ± 200PPM; Temperature Range: -55°C to +125°C; Voltage Rating: 50V
R65 = 4.7M/0805/0250W/150V: Resistor, 4.7M, 1%, 0.25W, 150V, 100PPM, 0805; Brand: MULTICOMP; Brand Number: MCHP05W4F4704T5E; Case Style: 0805; Order Code Supplier: 1576516; Power Rating: 0.25W; Price: 0,089; Resistance: 4.7M; Supplier: Farnell; Temperature Coefficient: ± 100PPM; Temperature Range: -55°C to +155°C; Voltage Rating: 150V
R66 = 270k/0402/0063W/50V: Resistor, 270k, 0.1%, 0.0625W, 50V, 100PPM, 0402; Brand: Panasonic; Brand Number: ERJ2GEJ274X; Power Rating: 0.063W; Case Style: 0402; Order Code Supplier: 2324291; Price: 0,0148; Resistance: 270K; Supplier: Farnell; Temperature Coefficient: ± 100PPM; Temperature Range: -55°C to +125°C; Voltage Rating: 50V
R67 = 1.5k/0402/0063W/50V: as R8 on sheet DB10011_Toplevel; Case Style: 0402; Order Code Supplier: 2121624; Price: 0,0054; Resistance: 1.5k; Supplier: Farnell; Temperature Coefficient: ± 100PPM; Temperature Range: -55°C to +125°C; Voltage Rating: 50V

## Sheet DB10011_Controller.SchDoc: uController
size A3; Engineer: Danny Bokma; Revision: V0.3; SheetNumber: 2; SheetTotal: 7
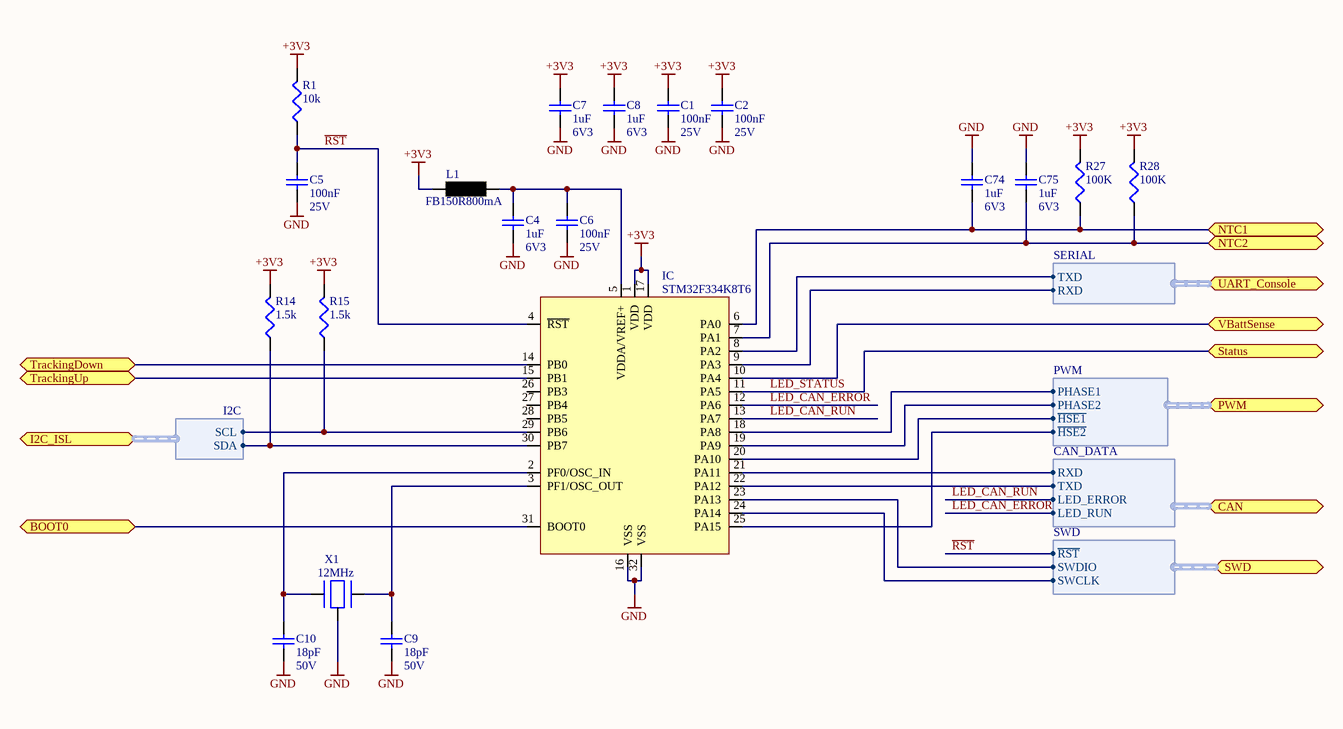
[diagram p3: DB10011_Controller.SchDoc]

### Parts
C1  100nF  Voltage Rating: 25V  [C0402]
C2  100nF  Voltage Rating: 25V  [C0402]
C4  1uF  Voltage Rating: 6V3  [C0402]
C5  100nF  Voltage Rating: 25V  [C0402]
C6  100nF  Voltage Rating: 25V  [C0402]
C7  1uF  Voltage Rating: 6V3  [C0402]
C8  1uF  Voltage Rating: 6V3  [C0402]
C9  18pF  Voltage Rating: 50V  [C0402]
C10  18pF  Voltage Rating: 50V  [C0402]
C74  1uF  Voltage Rating: 6V3  [C0402]
C75  1uF  Voltage Rating: 6V3  [C0402]
IC  STM32F334K8T6  [LQFP32]
L1  FB150R800mA  [0805]
R1  10k  [0402]
R14  1.5k  [0402]
R15  1.5k  [0402]
R27  100K  [0402]
R28  100K  [0402]
X1  12MHz  [7M]

### Ports
BOOT0, CAN (harness CAN_DATA), I2C_ISL (harness I2C), NTC1, NTC2, PWM (harness PWM), Status, SWD (harness SWD), TrackingDown, TrackingUp, UART_Console (harness SERIAL), VBattSense

### Harnesses
CAN_DATA: RXD, TXD, LED_ERROR, LED_RUN
I2C: SDA, SCL
SWD: SWCLK, SWDIO, ~{RST}
SERIAL: RXD, TXD
PWM: PHASE2, PHASE1, ~{HSE1}, ~{HSE2}

### Nets
+3V3: C1.2 C2.2 C7.2 C8.2 IC.1(VDD) IC.17(VDD) L1.1 R1.2 R14.2 R15.2 R27.2 R28.2
GND: C1.1 C2.1 C4.1 C5.1 C6.1 C7.1 C8.1 C9.1 C10.1 C74.2 C75.2 IC.16(VSS) IC.32(VSS) X1.0
BOOT0: IC.31(BOOT0) ; port BOOT0
LED_CAN_ERROR: IC.12(PA6) ; port CAN.LED_RUN
LED_CAN_RUN: IC.13(PA7) ; port CAN.LED_ERROR
LED_STATUS: IC.11(PA5) ; port Status
~{RST}: C5.2 IC.4(~{RST}) R1.1 ; port SWD.~{RST}
NetC3_2: IC.10(PA4) ; port VBattSense
NetC4_2: C4.2 C6.2 IC.5(VDDA/VREF+) L1.2
NetC9_2: C9.2 IC.3(PF1/OSC_OUT) X1.2
NetC10_2: C10.2 IC.2(PF0/OSC_IN) X1.1
NetC74_1: C74.1 IC.6(PA0) R27.1 ; port NTC1
NetC75_1: C75.1 IC.7(PA1) R28.1 ; port NTC2
NetIC_8: IC.8(PA2) ; port UART_Console.TXD
NetIC_9: IC.9(PA3) ; port UART_Console.RXD
NetIC_14: IC.14(PB0) ; port TrackingDown
NetIC_15: IC.15(PB1) ; port TrackingUp
NetIC_18: IC.18(PA8) ; port PWM.PHASE1
NetIC_19: IC.19(PA9) ; port PWM.PHASE2
NetIC_20: IC.20(PA10) ; port PWM.~{HSE1}
NetIC_21: IC.21(PA11) ; port CAN.RXD
NetIC_22: IC.22(PA12) ; port CAN.TXD
NetIC_23: IC.23(PA13) ; port SWD.SWDIO
NetIC_24: IC.24(PA14) ; port SWD.SWCLK
NetIC_25: IC.25(PA15) ; port PWM.~{HSE2}
NetIC_29: IC.29(PB6) R15.1 ; port I2C_ISL.SCL
NetIC_30: IC.30(PB7) R14.1 ; port I2C_ISL.SDA

Not connected (* = marked no-connect by the designer): IC 26(PB3) 27(PB4) 28(PB5)

### Notes on the sheet
- Title
- Size:
- Date:
- A3
- Number:
- Time:
- Revision:
- Sheet
- of
- File:

### Library data of the parts
C1 C2 C5 C6 = 100nF/0402/CER/25V: as C42 on sheet DB10011_Converter; Dielectric Characteristic: X7R; Capacitance: 100nF; Temperature Range: -55 to +125 C; Price: 0,0225; Order Code Supplier: 2456106; Supplier: Farnell
C4 C7 C8 C74 C75 = 1uF/0402/CER/6.3V: as C3 on sheet DB10011_Converter; Dielectric Characteristic: X5R; Capacitance: 1uF; Temperature Range: -55°C to +85°C; Price: 0,0874; Order Code Supplier: 1327658; Supplier: Farnell
C9 C10 = 18pF/0402/CER/50V: Capacitor, 18pF, 50V, NP0; Capacitance Tolerance: ± 5%; Capacitor Case Style: 0402; Brand Number: GRM1555C1H180JA01D; Brand: MURATA; Dielectric Characteristic: NP0; Capacitance: 18pF; Temperature Range: -55°C to 125°C; Price: 0,0177; Order Code Supplier: 1828876; Supplier: Farnell
IC = STM32F334K8T6: MCU, 32BIT CORTEX-M3, 72MHz, HRTIM; Brand: STM; Brand Number: STM32F334K8T6; Supplier: Mouser; Order Code Supplier: 511-STM32F334K8T6
L1 = LI0805H151R: Ferrite, 150R, 0.8Adc, 100MHz; Brand: LAIRD TECHNOLOGIES; Brand Number: LI0805H151R-10; DC Current: 1.3A; DC Resistance: 0.15Ohm; Case Style: 0805; Inductance: *; Order Code Supplier: 2292441; Price: 0,0407; Q Factor: *; Supplier: Farnell; Temperature Range: -40°C to +125°C
R1 = 10k/0402/0063W/50V: as R7 on sheet DB10011_Converter; Case Style: 0402; Order Code Supplier: 2121730; Price: 0,0005; Resistance: 10k; Supplier: Farnell; Temperature Coefficient: ± 100PPM; Temperature Range: -55°C to +125°C; Voltage Rating: 50V
R14 R15 = 1.5k/0402/0063W/50V: as R8 on sheet DB10011_Toplevel; Case Style: 0402; Order Code Supplier: 2121624; Price: 0,0054; Resistance: 1.5k; Supplier: Farnell; Temperature Coefficient: ± 100PPM; Temperature Range: -55°C to +125°C; Voltage Rating: 50V
R27 R28 = 100k/0402/0063W/50V: Resistor, 100k, 0.1%, 0.0625W, 50V, 100PPM, 0402; Brand: VISHAY DRALORIC; Brand Number: CRCW0402100KFKED; Power Rating: 0.063W; Case Style: 0402; Order Code Supplier: 2121857; Price: 0,0004; Resistance: 100K; Supplier: Farnell; Temperature Coefficient: ± 100PPM; Temperature Range: -55°C to +125°C; Voltage Rating: 50V
X1 = 7M-12.000MAAJ-T: CRYSTAL, 12MHz,18PF CL, 3.2X2.5MM SMT; Brand: TXC; Order Code Supplier: 1842056; Price: 1,45; Supplier: Farnell; Brand Number: 7M-12.000MAAJ-T

## Sheet DB10011_CANTranceiver.SchDoc: CAN Transceiver
size A4; Engineer: Danny Bokma; Revision: V0.3; SheetNumber: 6; SheetTotal: 7
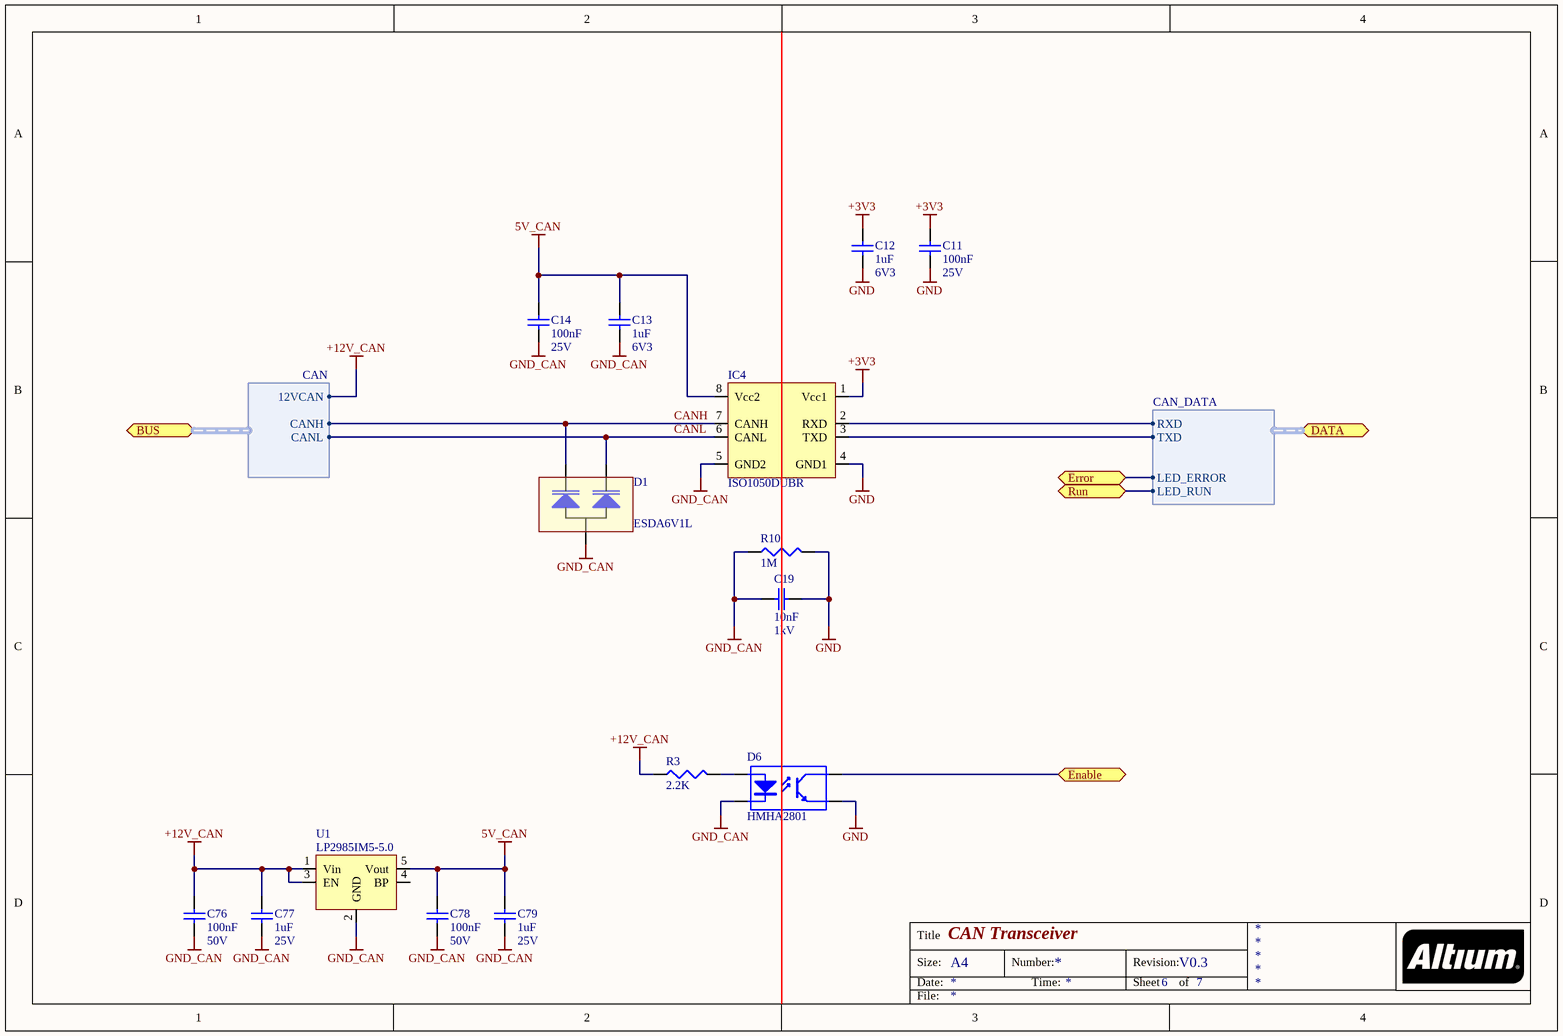
[diagram p4: DB10011_CANTranceiver.SchDoc]

### Parts
C11  100nF  Voltage Rating: 25V  [C0402]
C12  1uF  Voltage Rating: 6V3  [C0402]
C13  1uF  Voltage Rating: 6V3  [C0402]
C14  100nF  Voltage Rating: 25V  [C0402]
C19  10nF  Voltage Rating: 1kV  [C-1206]
C76  100nF  Voltage Rating: 50V  [C0603]
C77  1uF  Voltage Rating: 25V  [C0603]
C78  100nF  Voltage Rating: 50V  [C0603]
C79  1uF  Voltage Rating: 25V  [C0603]
D1  ESDA6V1L  [SOT23]
D6  HMHA2801  [FSOP4]
IC4  ISO1050DUBR  [PDSO8]
R3  2.2K  [0603]
R10  1M  [1206]
U1  LP2985IM5-5.0  [SOT-23-5]

### Ports
BUS (harness CAN), DATA (harness CAN_DATA), Enable, Error, Run

### Harnesses
CAN_DATA: RXD, TXD, LED_ERROR, LED_RUN
CAN: 12VCAN, CANL, CANH

### Nets
5V_CAN: C13.2 C14.2 C78.2 C79.2 IC4.8(Vcc2) U1.5(Vout)
+3V3: C11.2 C12.2 IC4.1(Vcc1)
+12V_CAN: C76.2 C77.2 R3.2 U1.1(Vin) U1.3(EN) ; port BUS.12VCAN
GND: C11.1 C12.1 C19.1 D6.3(E1) IC4.4(GND1) R10.1
GND_CAN: C13.1 C14.1 C19.2 C76.1 C77.1 C78.1 C79.1 D1.A D6.2(K1) IC4.5(GND2) R10.2 U1.2(GND)
CANH: D1.K1 IC4.7(CANH) ; port BUS.CANH
CANL: D1.K2 IC4.6(CANL) ; port BUS.CANL
LED_CAN_ERROR: port Run, port DATA.LED_RUN
LED_CAN_RUN: port Error, port DATA.LED_ERROR
NetD6_1: D6.1(A1) R3.1
NetD6_4: D6.4(C1) ; port Enable
NetIC_21: IC4.2(RXD) ; port DATA.RXD
NetIC_22: IC4.3(TXD) ; port DATA.TXD

Not connected (* = marked no-connect by the designer): U1 4(BP)

### Notes on the sheet
- Title
- Size:
- Date:
- A4
- Number:
- Time:
- Revision:
- Sheet
- of
- File:

### Library data of the parts
C11 C14 = 100nF/0402/CER/25V: as C42 on sheet DB10011_Converter; Dielectric Characteristic: X7R; Capacitance: 100nF; Temperature Range: -55 to +125 C; Price: 0,0225; Order Code Supplier: 2456106; Supplier: Farnell
C12 C13 = 1uF/0402/CER/6.3V: as C3 on sheet DB10011_Converter; Dielectric Characteristic: X5R; Capacitance: 1uF; Temperature Range: -55°C to +85°C; Price: 0,0874; Order Code Supplier: 1327658; Supplier: Farnell
C19 = 10nF/1206/CER/1kV: Capacitor, F, 1kV, X7R; Capacitance Tolerance: ± 10%; Capacitor Case Style: 1206; Brand Number: GRM31CR73A103KW03L; Brand: Murata; Dielectric Characteristic: X7R; Capacitance: 10nF; Temperature Range: -55°C to +125°C; Price: 0,259; Order Code Supplier: 2494297; Supplier: Farnell
C76 C78 = 100nF/0603/CER/50V: as C55 on sheet DB10011_Converter; Dielectric Characteristic: X7R; Capacitance: 100nF; Temperature Range: -55°C to +125°C; Price: 0,008; Order Code Supplier: 1759122RL; Supplier: Farnell
C77 C79 = 1uF/0603/CER/25V: as C16 on sheet DB10011_Converter; Dielectric Characteristic: X7R; Capacitance: 1uF; Temperature Range: -55°C to +125°C; Price: 0,186; Order Code Supplier: 1735540; Supplier: Farnell
D1 = ESDA6V1L: Diode TVS Dual, Vrwm: 5.25V, Vbr: 7.2V, Vc: 12.45V, Ippm: 15A; Brand: STMICROELECTRONICS; Case Style: SOT-23; Brand Number: ESDA6V1L; Breakdown Voltage: 7.2V; Clamping Voltage: 12.45V; Ippm: 15A; Order Code Supplier: 9802258; Price: 0,62; Supplier: Farnell; Temperature Range: -40°C to +125°C; Vrwm: 5.25V
D6 = HMHA2801: as D2 on sheet DB10011_Converter; Brand Number: HMHA2801; Case Style: *; Price: 0,28; Order Code Supplier: 1652504; Supplier: Farnell; Temperature Range: -55°C to +100°C
IC4 = ISO1050DUBR: CAN TRANSCEIVER; Brand: Texas Instruments; Case Style: SO8; Brand Number: ISO1050DUBR; Order Code Supplier: 1755712; Price: 5,44; Supplier: Farnell; Temperature Range: -55°C to +155°C
R3 = 2.2K/0603/0063W/50V: Resistor, 2.2K, 1%, 0.063W, 50V, 100PPM, 0603; Brand: VISHAY DRALORIC; Brand Number: CRCW06032K20FKEA; Case Style: 0603; Order Code Supplier: 2122405; Power Rating: 0.063W; Price: 0,038; Resistance: 2.2K; Supplier: Farnell; Temperature Coefficient: ± 100PPM; Temperature Range: -55°C to +125°C; Voltage Rating: 50V
R10 = 1M/1206/0300W/1kV: Resistor, 1M, 1%, 0.25W, 1kV, 200PPM, 1206; Brand: WELWYN; Brand Number: HVC1206-1M0FT3; Power Rating: 0.3W; Temperature Coefficient: ± 100PPM; Case Style: 1206; Order Code Supplier: 2340649; Price: 1,44; Resistance: 1M; Supplier: Farnell; Temperature Range: -55°C to +155°C; Voltage Rating: 1kV
U1 = LP2985IM5-5.0: LDO, 280mVDO, 5V, 0.15A, 1%; Brand: TEXAS INSTRUMENTS; Brand Number: LP2985IM5-5.0/NOPB; Vin-min: 2.5V; Vin-max: 16V; Case Style: SOT-23-5; Current: 0.15A; Vout: 5V; Order Code Supplier: 1564671; Price: 0,69; Supplier: Farnell; Temperature Range: -40°C to +85°C

## Sheet DB10011_USBToSerial.SchDoc
size A4; Engineer: Danny Bokma; Revision: V0.3; SheetNumber: 5; SheetTotal: 7
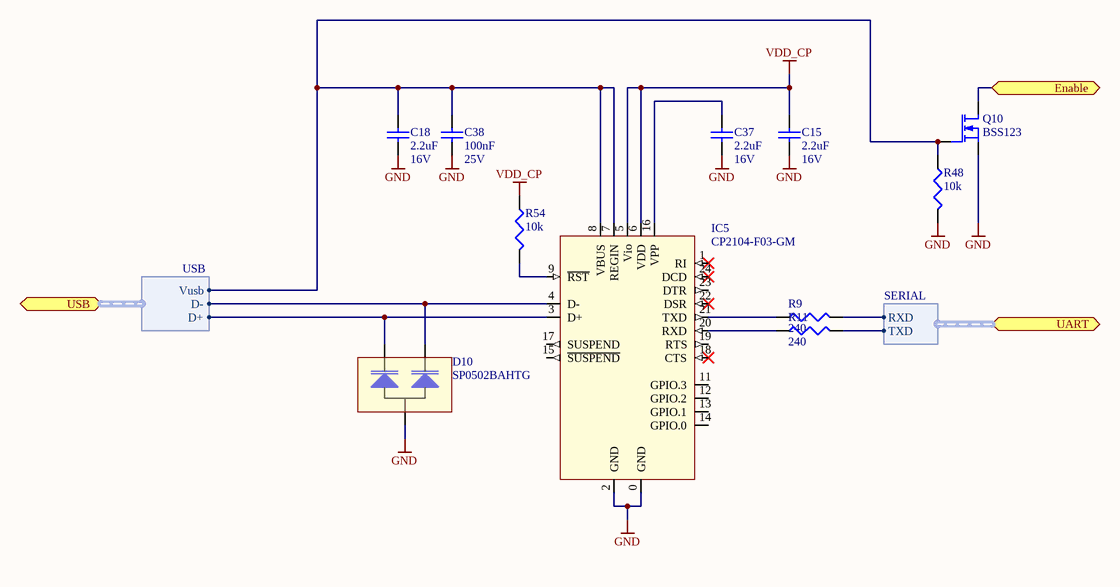
[diagram p5: DB10011_USBToSerial.SchDoc]

### Parts
C15  2.2uF  Voltage Rating: 16V  [C0603]
C18  2.2uF  Voltage Rating: 16V  [C0603]
C37  2.2uF  Voltage Rating: 16V  [C0603]
C38  100nF  Voltage Rating: 25V  [C0402]
D10  SP0502BAHTG  [SOT23]
IC5  CP2104-F03-GM  [QFN24]
Q10  BSS123  [SOT-23]
R9  240  [0402]
R11  240  [0402]
R48  10k  [0402]
R54  10k  [0402]

### Ports
Enable, UART (harness SERIAL), USB (harness USB)

### Harnesses
USB: Vusb, D+, D-
SERIAL: RXD, TXD

### Nets
GND: C15.1 C18.1 C37.1 C38.1 D10.A IC5.0(GND) IC5.2(GND) Q10.S R48.1
VDD_CP: C15.2 IC5.5(Vio) IC5.6(VDD) R54.2
NetC18_2: C18.2 C38.2 IC5.7(REGIN) IC5.8(VBUS) Q10.G R48.2 ; port USB.Vusb
NetC37_2: C37.2 IC5.16(VPP)
NetD6_4: Q10.D ; port Enable
NetD10_K1: D10.K1 IC5.4(D-) ; port USB.D-
NetD10_K2: D10.K2 IC5.3(D+) ; port USB.D+
NetIC5_9: IC5.9(~{RST}) R54.1
NetIC5_20: IC5.20(RXD) R11.2
NetIC5_21: IC5.21(TXD) R9.2
NetIC_8: R11.1 ; port UART.TXD
NetIC_9: R9.1 ; port UART.RXD

Not connected (* = marked no-connect by the designer): IC5 1(RI)* 11(GPIO.3) 12(GPIO.2) 13(GPIO.1) 14(GPIO.0) 15(~{SUSPEND}) 17(SUSPEND) 18(CTS)* 19(RTS) 22(DSR)* 23(DTR) 24(DCD)*

### Notes on the sheet
- Title
- Size:
- Date:
- A4
- Number:
- Time:
- Revision:
- Sheet
- of
- File:

### Library data of the parts
C15 C18 C37 = 2.2uF/0603/CER/16V: Capacitor, 2.2uF, 16V, X5R; Capacitance Tolerance: +/- 10%; Capacitor Case Style: 0603; Brand Number: GRM188R61C225KE15D; Brand: MURATA; Dielectric Characteristic: X5R; Capacitance: 2.2uF; Temperature Range: -55°C to 85°C; Price: 0,077; Order Code Supplier: 1735526; Supplier: Farnell
C38 = 100nF/0402/CER/25V: as C42 on sheet DB10011_Converter; Dielectric Characteristic: X7R; Capacitance: 100nF; Temperature Range: -55 to +125 C; Price: 0,0225; Order Code Supplier: 2456106; Supplier: Farnell
D10 = SP0502BAHTG: Diode TVS Dual, Vrwm: 5.5V Vc: 8V; Brand: LITTLEFUSE; Case Style: SOT-23; Brand Number: SP0502BAHTG; Clamping Voltage: 8V; Order Code Supplier: 1827631; Price: 0,80; Supplier: Farnell; Temperature Range: -40°C to +125°C; Vrwm: 5.5V
IC5 = CP2104-F03-GM: USB to UART converter; Brand: Silicon Labs; Case Style: QFN24; Price: 1,65; Order Code Supplier: 757-4983; Brand Number: CP2104-F03-GM; Supplier: RS-Components
Q10 = BSS123: as Q6 on sheet DB10011_Power; Brand Number: BSS123; Case Style: SOT-23; Order Code Supplier: 1510764; Price: 0,082; Supplier: Farnell; Temperature Range: -55°C to +150°C; Transistor Polarity: N-channel
R9 R11 = 240/0402/0063W/50V: Resistor, 240, 0.1%, 0.0625W, 50V, 100PPM, 0402; Brand: VISHAY DRALORIC; Brand Number: CRCW0402240RFKED; Power Rating: 0.063W; Case Style: 0402; Order Code Supplier: 2121522; Price: 0,0006; Resistance: 240; Supplier: Farnell; Temperature Coefficient: ± 100PPM; Temperature Range: -55°C to +125°C; Voltage Rating: 50V
R48 R54 = 10k/0402/0063W/50V: as R7 on sheet DB10011_Converter; Case Style: 0402; Order Code Supplier: 2121730; Price: 0,0005; Resistance: 10k; Supplier: Farnell; Temperature Coefficient: ± 100PPM; Temperature Range: -55°C to +125°C; Voltage Rating: 50V

## Sheet DB10011_CANConnector.SchDoc: CAN Connectors
size A4; Engineer: Danny Bokma; Revision: V0.3; SheetNumber: 7; SheetTotal: 7
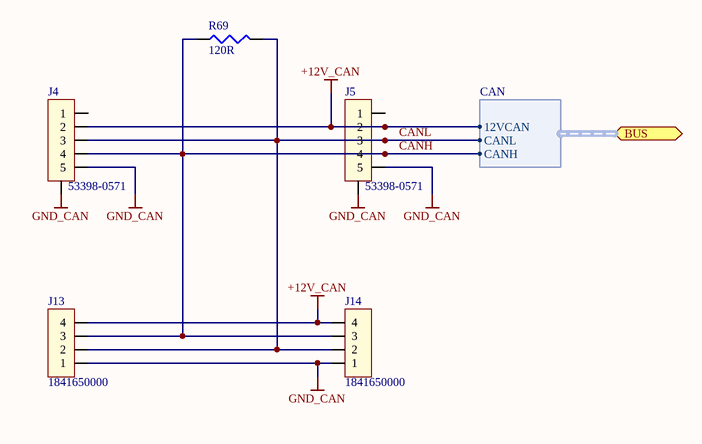
[diagram p6: DB10011_CANConnector.SchDoc]

### Parts
J4  53398-0571  [53398-0571]
J5  53398-0571  [53398-0571]
J13  1841650000  [1841650000]
J14  1841650000  [1841650000]
R69  120R  [0805]

### Ports
BUS (harness CAN)

### Harnesses
CAN: 12VCAN, CANL, CANH

### Nets
+12V_CAN: J4.2 J5.2 J13.4 J14.4 ; port BUS.12VCAN
GND_CAN: J4.0(SHLD) J4.5 J5.0(SHLD) J5.5 J13.1 J14.1
CANH: J4.4 J5.4 J13.3 J14.3 R69.2 ; port BUS.CANH
CANL: J4.3 J5.3 J13.2 J14.2 R69.1 ; port BUS.CANL

Not connected (* = marked no-connect by the designer): J4 1; J5 1

### Notes on the sheet
- Title
- Size:
- Date:
- A4
- Number:
- Time:
- Revision:
- Sheet
- of
- File:

### Library data of the parts
J4 J5 = 53398-0571: PicoBlade 53398 Series, 5Pin, Right Angle; Brand: MOLEX; Pitch: 1.25mm; Brand Number: 53398-0571; Case Style: 53398-0571; Order Code Supplier: 1125354; Price: 1,55; Supplier: Farnell
J13 J14 = 1841650000: SL-SMT Header, 3.5 mm, 4 Ways, 15 A, 320 V; Brand: Weidmuller; Pitch: 3.5mm; Brand Number: 1841650000; Case Style: SL-SMT; Order Code Supplier: 2077078; Price: 6.77; Supplier: Farnell
R69 = 0/0805/0100W/150V: Resistor, 0R, 0.1%, 0.1W, 150V, 200PPM, 0805; Brand: MULTICOMP; Brand Number: MC 0.1W 0805 0R; Case Style: 0805; Order Code Supplier: 9333681; Power Rating: 0.1W; Price: 0,038; Resistance: 0R; Supplier: Farnell; Temperature Coefficient: ± 200PPM; Temperature Range: -55°C to +125°C; Voltage Rating: 150V

## Nets that join several sheets
+3V3: DB10011_Toplevel (J10.1 J11.2), DB10011_Power (5 pins), DB10011_Converter (14 pins), DB10011_Controller (12 pins), DB10011_CANTranceiver (C11.2 C12.2 IC4.1)
+10V_1: DB10011_Power (C59.2 R33.1 R61.2), DB10011_Converter (C16.2 C55.1 IC2.1)
+10V_2: DB10011_Power (C65.2 R39.1 R63.2), DB10011_Converter (C17.2 C56.1 IC3.1)
+12V_CAN: DB10011_CANTranceiver (5 pins), DB10011_CANConnector (J4.2 J5.2 J13.4 J14.4)
BATT: DB10011_Toplevel (F1.2), DB10011_Converter (15 pins)
GND: DB10011_Toplevel (18 pins), DB10011_Power (35 pins), DB10011_Converter (50 pins), DB10011_Controller (14 pins), DB10011_CANTranceiver (6 pins), DB10011_USBToSerial (9 pins)
GND_CAN: DB10011_CANTranceiver (12 pins), DB10011_CANConnector (6 pins)
VBatOut: DB10011_Toplevel (J1.3 J9.0), DB10011_Converter (F4.2 F5.2)
VPVIn: DB10011_Toplevel (J1.2 J8.0), DB10011_Converter (C20.1 L5.1)
BOOT0: DB10011_Toplevel (J11.1 R8.2), DB10011_Controller (IC.31)
CANH: DB10011_CANTranceiver (D1.K1 IC4.7), DB10011_CANConnector (5 pins)
CANL: DB10011_CANTranceiver (D1.K2 IC4.6), DB10011_CANConnector (5 pins)
LED_CAN_ERROR: DB10011_Toplevel (R17.2), DB10011_Controller (IC.12)
LED_CAN_RUN: DB10011_Toplevel (R6.2), DB10011_Controller (IC.13)
LED_STATUS: DB10011_Toplevel (R24.2), DB10011_Controller (IC.11)
NetC3_2: DB10011_Converter (C3.2 D2.3 R66.2), DB10011_Controller (IC.10)
NetC18_2: DB10011_Toplevel (J7.1), DB10011_USBToSerial (6 pins)
NetC74_1: DB10011_Toplevel (R30.2), DB10011_Controller (C74.1 IC.6 R27.1)
NetC75_1: DB10011_Toplevel (R31.2), DB10011_Controller (C75.1 IC.7 R28.1)
NetD6_4: DB10011_Power (D11.2 Q6.G R42.1), DB10011_CANTranceiver (D6.4), DB10011_USBToSerial (Q10.D)
NetD10_K1: DB10011_Toplevel (J7.2), DB10011_USBToSerial (D10.K1 IC5.4)
NetD10_K2: DB10011_Toplevel (J7.3), DB10011_USBToSerial (D10.K2 IC5.3)
NetF1_1: DB10011_Toplevel (F1.1), DB10011_Power (R32.2 R38.2 R55.2)
NetIC_8: DB10011_Controller (IC.8), DB10011_USBToSerial (R11.1)
NetIC_9: DB10011_Controller (IC.9), DB10011_USBToSerial (R9.1)
NetIC_14: DB10011_Toplevel (R4.2), DB10011_Controller (IC.14)
NetIC_15: DB10011_Toplevel (R25.2), DB10011_Controller (IC.15)
NetIC_18: DB10011_Converter (R50.1), DB10011_Controller (IC.18)
NetIC_19: DB10011_Converter (R51.1), DB10011_Controller (IC.19)
NetIC_20: DB10011_Converter (IC1.2 R7.1), DB10011_Controller (IC.20)
NetIC_21: DB10011_Controller (IC.21), DB10011_CANTranceiver (IC4.2)
NetIC_22: DB10011_Controller (IC.22), DB10011_CANTranceiver (IC4.3)
NetIC_23: DB10011_Toplevel (J10.3), DB10011_Controller (IC.23)
NetIC_24: DB10011_Toplevel (J10.4), DB10011_Controller (IC.24)
NetIC_25: DB10011_Converter (IC6.2 R13.1), DB10011_Controller (IC.25)
NetIC_29: DB10011_Converter (IC8.4 IC9.4), DB10011_Controller (IC.29 R15.1)
NetIC_30: DB10011_Converter (IC8.5 IC9.5), DB10011_Controller (IC.30 R14.1)
~{RST}: DB10011_Toplevel (J10.2), DB10011_Controller (C5.2 IC.4 R1.1)

## Assembly variants
Production: not fitted J2 J3 R59 R60